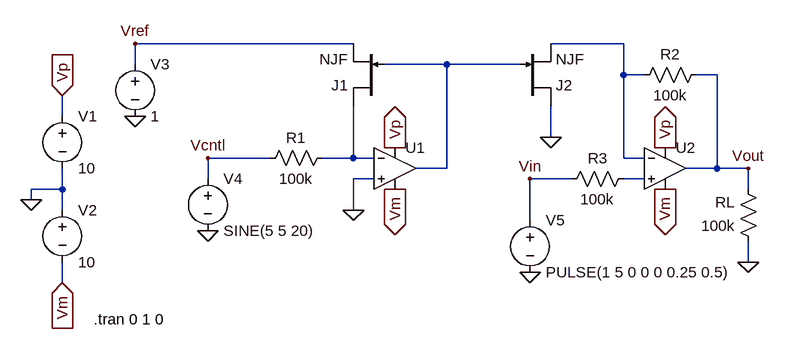
[diagram p0: schematic Voltage-Controlled-Amplifier.asc]
Voltage-Controlled-Amplifier.asc, the LTspice schematic file:
Version 4
SHEET 1 880 680
WIRE 64 -48 -272 -48
WIRE 480 -48 368 -48
WIRE -272 -16 -272 -48
WIRE 208 -16 112 -16
WIRE 320 -16 208 -16
WIRE 480 0 480 -48
WIRE 512 0 480 0
WIRE 624 0 592 0
WIRE -384 64 -384 32
WIRE 368 96 368 48
WIRE -64 128 -160 128
WIRE 64 128 64 48
WIRE 64 128 16 128
WIRE 96 128 64 128
WIRE 480 128 480 0
WIRE 512 128 480 128
WIRE 208 144 208 -16
WIRE 208 144 160 144
WIRE 624 144 624 0
WIRE 624 144 576 144
WIRE 672 144 624 144
WIRE -160 160 -160 128
WIRE 96 160 64 160
WIRE 400 160 336 160
WIRE 512 160 480 160
WIRE -384 176 -384 144
WIRE -384 176 -432 176
WIRE 672 176 672 144
WIRE -432 192 -432 176
WIRE -384 208 -384 176
WIRE 64 208 64 160
WIRE 336 224 336 160
WIRE 672 288 672 256
WIRE -384 320 -384 288
FLAG 64 208 0
FLAG 368 96 0
FLAG 672 288 0
FLAG -272 64 0
FLAG -160 240 0
FLAG 336 304 0
FLAG -432 192 0
FLAG -384 32 Vp
IOPIN -384 32 In
FLAG -384 320 Vm
IOPIN -384 320 In
FLAG 128 176 Vm
IOPIN 128 176 Out
FLAG 544 176 Vm
IOPIN 544 176 Out
FLAG 544 112 Vp
IOPIN 544 112 Out
FLAG 128 112 Vp
IOPIN 128 112 Out
FLAG 672 144 Vout
FLAG -160 128 Vcntl
FLAG 336 160 Vin
FLAG -272 -48 Vref
SYMBOL OpAmps\\UniversalOpAmp 128 144 R0
SYMATTR InstName U1
SYMBOL OpAmps\\UniversalOpAmp 544 144 R0
SYMATTR InstName U2
SYMBOL res 608 -16 R90
WINDOW 0 0 56 VBottom 2
WINDOW 3 32 56 VTop 2
SYMATTR InstName R2
SYMATTR Value 100k
SYMBOL res 688 272 R180
WINDOW 0 36 76 Left 2
WINDOW 3 36 40 Left 2
SYMATTR InstName RL
SYMATTR Value 100k
SYMBOL res 384 176 R270
WINDOW 0 32 56 VTop 2
WINDOW 3 0 56 VBottom 2
SYMATTR InstName R3
SYMATTR Value 100k
SYMBOL res -80 144 R270
WINDOW 0 32 56 VTop 2
WINDOW 3 0 56 VBottom 2
SYMATTR InstName R1
SYMATTR Value 100k
SYMBOL njf 112 48 R180
SYMATTR InstName J1
SYMBOL njf 320 48 M180
SYMATTR InstName J2
SYMBOL voltage -272 -32 R0
WINDOW 123 0 0 Left 0
WINDOW 39 0 0 Left 0
SYMATTR InstName V3
SYMATTR Value 1
SYMBOL voltage 336 208 R0
WINDOW 123 0 0 Left 0
WINDOW 39 0 0 Left 0
SYMATTR InstName V5
SYMATTR Value PULSE(1 5 0 0 0 0.25 0.5)
SYMBOL voltage -384 48 R0
WINDOW 123 0 0 Left 0
WINDOW 39 0 0 Left 0
SYMATTR InstName V1
SYMATTR Value 10
SYMBOL voltage -384 192 R0
WINDOW 123 0 0 Left 0
WINDOW 39 0 0 Left 0
SYMATTR InstName V2
SYMATTR Value 10
SYMBOL voltage -160 144 R0
WINDOW 123 0 0 Left 0
WINDOW 39 0 0 Left 0
SYMATTR InstName V4
SYMATTR Value SINE(5 5 20)
TEXT -336 376 Left 2 !.tran 0 1 0

The netlist it stands for:
* Voltage-Controlled-Amplifier.asc
XU1 0 N003 Vp Vm N002 level1 Avol=1Meg GBW=10Meg Vos=0 En=0 Enk=0 In=0 Ink=0 Rin=500Meg  ; pins In+ In- V+ V- OUT
XU2 N004 N001 Vp Vm Vout level1 Avol=1Meg GBW=10Meg Vos=0 En=0 Enk=0 In=0 Ink=0 Rin=500Meg  ; pins In+ In- V+ V- OUT
R2 Vout N001 100k
RL 0 Vout 100k
R3 Vin N004 100k
R1 Vcntl N003 100k
J1 N003 N002 Vref NJF
J2 0 N002 N001 NJF
V3 Vref 0 1
V5 Vin 0 PULSE(1 5 0 0 0 0.25 0.5)
V1 Vp 0 10
V2 0 Vm 10
V4 Vcntl 0 SINE(5 5 20)
.model NJF NJF
.model PJF PJF
.lib standard.jft
.tran 0 1 0
.lib UniversalOpAmp1.lib
.backanno
.end